# Altium schematic sheet [01] - COVER PAGE.SchDoc: 28 PIN Arduino Clone
size A3; Author: Oğuzhan GÜVERCİN; SheetNumber: 1; SheetTotal: 3; Project Code: V1I1
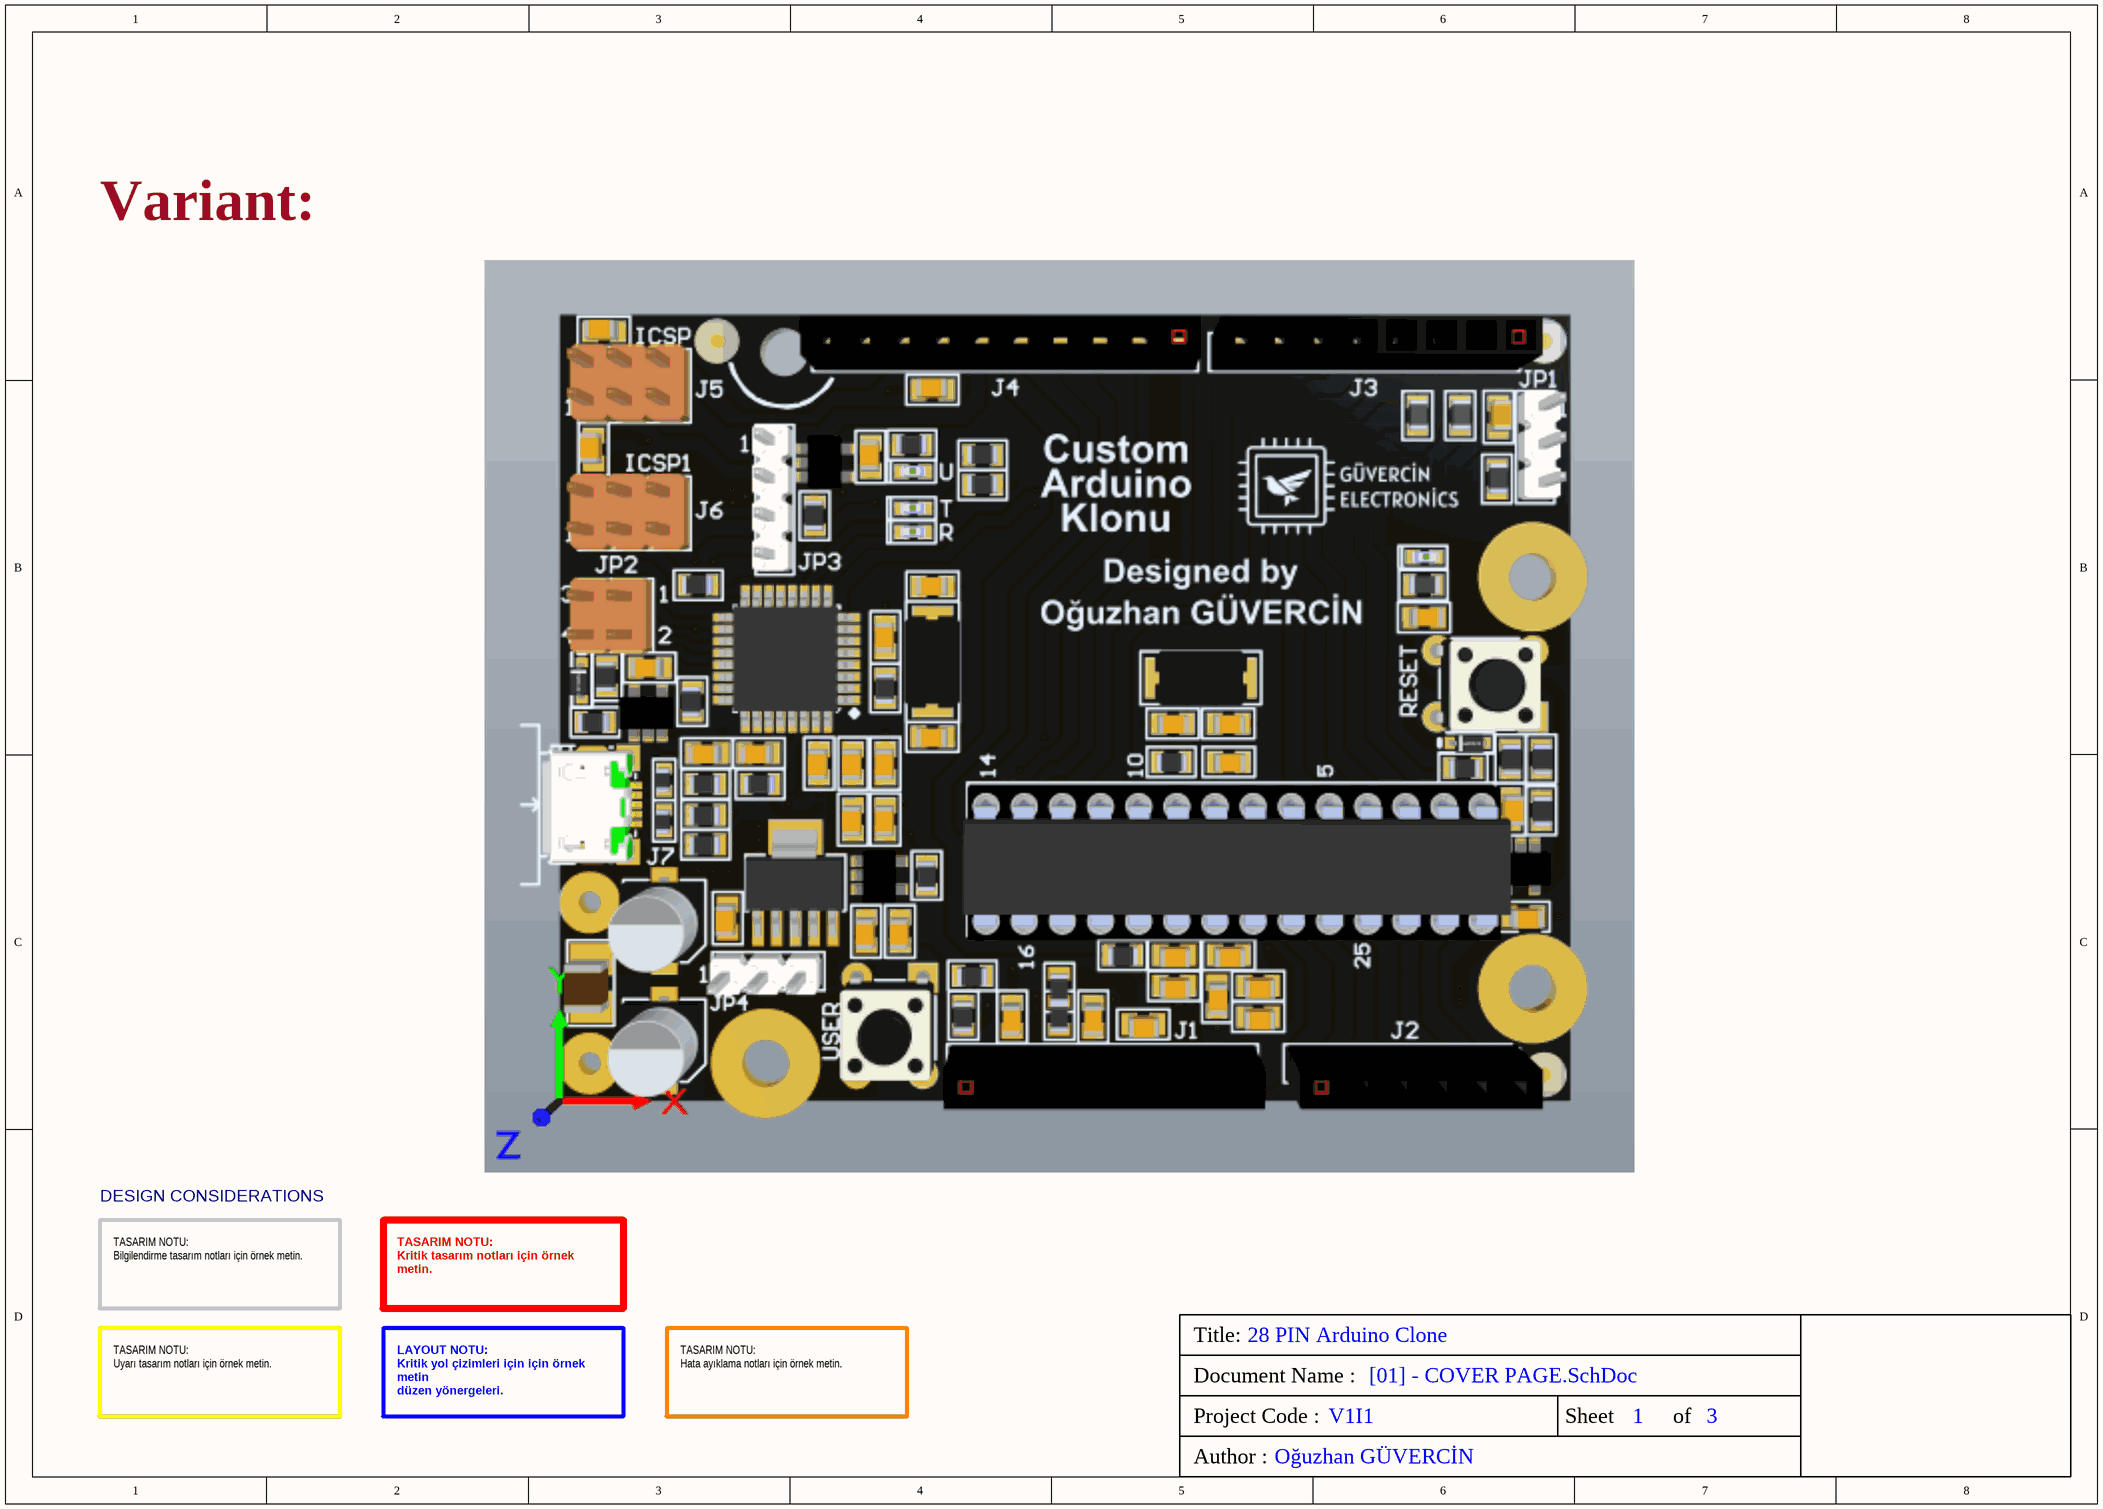
[diagram p0: [01] - COVER PAGE.SchDoc]

## Notes on the sheet
- Variant:
- DESIGN CONSIDERATIONS
- TASARIM NOTU:
  Bilgilendirme tasarım notları için örnek metin.
- TASARIM NOTU:
  Kritik tasarım notları için örnek metin.
- TASARIM NOTU:
  Uyarı tasarım notları için örnek metin.
- LAYOUT NOTU:
  Kritik yol çizimleri için için örnek metin
  düzen yönergeleri.
- TASARIM NOTU:
  Hata ayıklama notları için örnek metin.
- Title:
- Document Name :
- Project Code :
- Sheet
- of
- Author :